# EAGLE design proto (EAGLE 7.3.0)
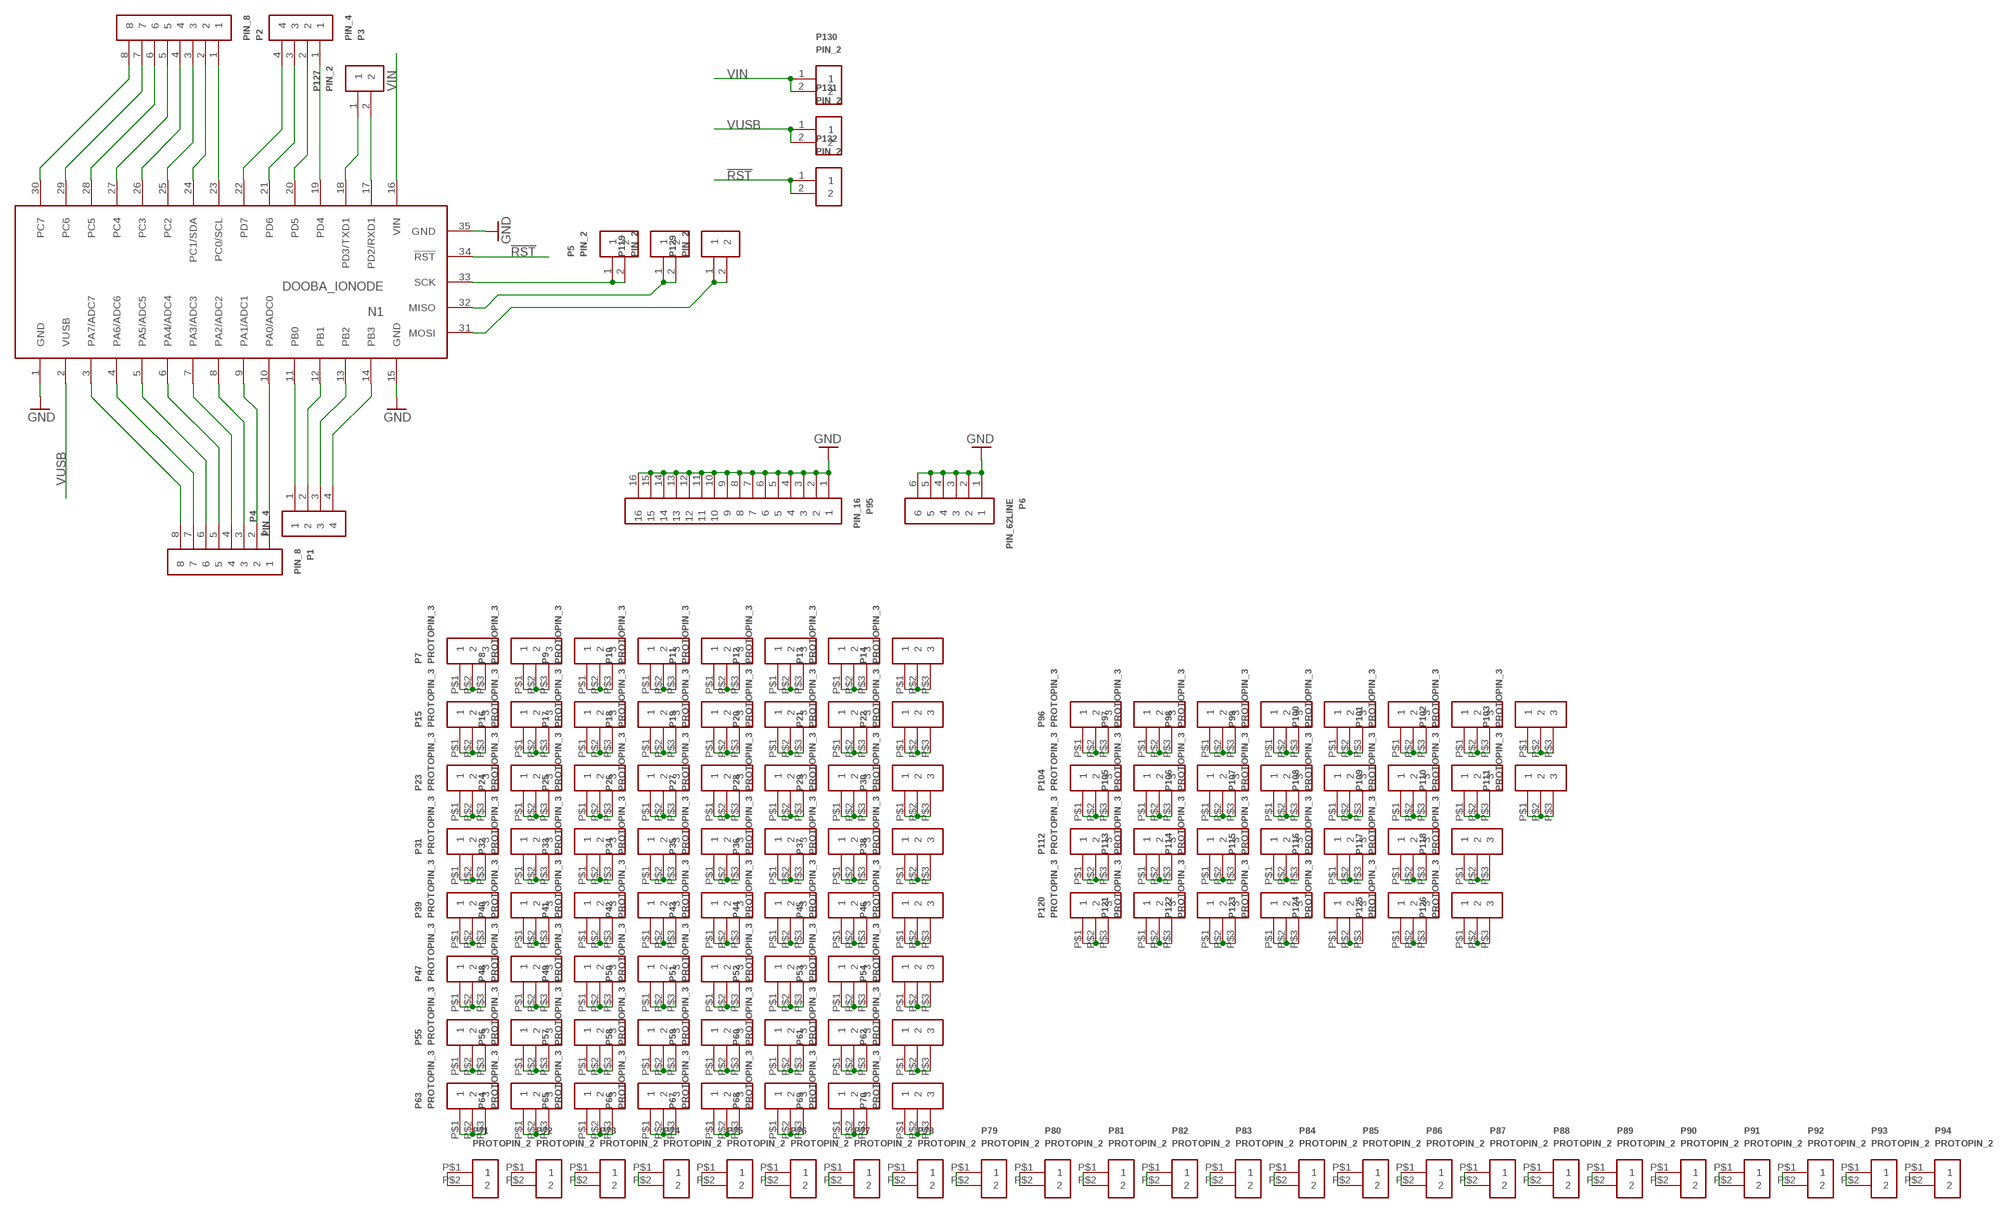
[diagram p0: schematic, sheet 1]

## Parts
N1  DOOBA_IONODE  [DOOBA_IONODE]
P1  PIN_8  [PIN_8]
P2  PIN_8  [PIN_8]
P3  PIN_4  [PIN_4]
P4  PIN_4  [PIN_4]
P5  PIN_2  [PIN_2]
P6  PIN_62LINE  [PIN_3X2]
P7  PROTOPIN_3  [PROTOPIN_3]
P8  PROTOPIN_3  [PROTOPIN_3]
P9  PROTOPIN_3  [PROTOPIN_3]
P10  PROTOPIN_3  [PROTOPIN_3]
P11  PROTOPIN_3  [PROTOPIN_3]
P12  PROTOPIN_3  [PROTOPIN_3]
P13  PROTOPIN_3  [PROTOPIN_3]
P14  PROTOPIN_3  [PROTOPIN_3]
P15  PROTOPIN_3  [PROTOPIN_3]
P16  PROTOPIN_3  [PROTOPIN_3]
P17  PROTOPIN_3  [PROTOPIN_3]
P18  PROTOPIN_3  [PROTOPIN_3]
P19  PROTOPIN_3  [PROTOPIN_3]
P20  PROTOPIN_3  [PROTOPIN_3]
P21  PROTOPIN_3  [PROTOPIN_3]
P22  PROTOPIN_3  [PROTOPIN_3]
P23  PROTOPIN_3  [PROTOPIN_3]
P24  PROTOPIN_3  [PROTOPIN_3]
P25  PROTOPIN_3  [PROTOPIN_3]
P26  PROTOPIN_3  [PROTOPIN_3]
P27  PROTOPIN_3  [PROTOPIN_3]
P28  PROTOPIN_3  [PROTOPIN_3]
P29  PROTOPIN_3  [PROTOPIN_3]
P30  PROTOPIN_3  [PROTOPIN_3]
P31  PROTOPIN_3  [PROTOPIN_3]
P32  PROTOPIN_3  [PROTOPIN_3]
P33  PROTOPIN_3  [PROTOPIN_3]
P34  PROTOPIN_3  [PROTOPIN_3]
P35  PROTOPIN_3  [PROTOPIN_3]
P36  PROTOPIN_3  [PROTOPIN_3]
P37  PROTOPIN_3  [PROTOPIN_3]
P38  PROTOPIN_3  [PROTOPIN_3]
P39  PROTOPIN_3  [PROTOPIN_3]
P40  PROTOPIN_3  [PROTOPIN_3]
P41  PROTOPIN_3  [PROTOPIN_3]
P42  PROTOPIN_3  [PROTOPIN_3]
P43  PROTOPIN_3  [PROTOPIN_3]
P44  PROTOPIN_3  [PROTOPIN_3]
P45  PROTOPIN_3  [PROTOPIN_3]
P46  PROTOPIN_3  [PROTOPIN_3]
P47  PROTOPIN_3  [PROTOPIN_3]
P48  PROTOPIN_3  [PROTOPIN_3]
P49  PROTOPIN_3  [PROTOPIN_3]
P50  PROTOPIN_3  [PROTOPIN_3]
P51  PROTOPIN_3  [PROTOPIN_3]
P52  PROTOPIN_3  [PROTOPIN_3]
P53  PROTOPIN_3  [PROTOPIN_3]
P54  PROTOPIN_3  [PROTOPIN_3]
P55  PROTOPIN_3  [PROTOPIN_3]
P56  PROTOPIN_3  [PROTOPIN_3]
P57  PROTOPIN_3  [PROTOPIN_3]
P58  PROTOPIN_3  [PROTOPIN_3]
P59  PROTOPIN_3  [PROTOPIN_3]
P60  PROTOPIN_3  [PROTOPIN_3]
P61  PROTOPIN_3  [PROTOPIN_3]
P62  PROTOPIN_3  [PROTOPIN_3]
P63  PROTOPIN_3  [PROTOPIN_3]
P64  PROTOPIN_3  [PROTOPIN_3]
P65  PROTOPIN_3  [PROTOPIN_3]
P66  PROTOPIN_3  [PROTOPIN_3]
P67  PROTOPIN_3  [PROTOPIN_3]
P68  PROTOPIN_3  [PROTOPIN_3]
P69  PROTOPIN_3  [PROTOPIN_3]
P70  PROTOPIN_3  [PROTOPIN_3]
P71  PROTOPIN_2  [PROTOPIN_2]
P72  PROTOPIN_2  [PROTOPIN_2]
P73  PROTOPIN_2  [PROTOPIN_2]
P74  PROTOPIN_2  [PROTOPIN_2]
P75  PROTOPIN_2  [PROTOPIN_2]
P76  PROTOPIN_2  [PROTOPIN_2]
P77  PROTOPIN_2  [PROTOPIN_2]
P78  PROTOPIN_2  [PROTOPIN_2]
P79  PROTOPIN_2  [PROTOPIN_2]
P80  PROTOPIN_2  [PROTOPIN_2]
P81  PROTOPIN_2  [PROTOPIN_2]
P82  PROTOPIN_2  [PROTOPIN_2]
P83  PROTOPIN_2  [PROTOPIN_2]
P84  PROTOPIN_2  [PROTOPIN_2]
P85  PROTOPIN_2  [PROTOPIN_2]
P86  PROTOPIN_2  [PROTOPIN_2]
P87  PROTOPIN_2  [PROTOPIN_2]
P88  PROTOPIN_2  [PROTOPIN_2]
P89  PROTOPIN_2  [PROTOPIN_2]
P90  PROTOPIN_2  [PROTOPIN_2]
P91  PROTOPIN_2  [PROTOPIN_2]
P92  PROTOPIN_2  [PROTOPIN_2]
P93  PROTOPIN_2  [PROTOPIN_2]
P94  PROTOPIN_2  [PROTOPIN_2]
P95  PIN_16  [PIN_16]
P96  PROTOPIN_3  [PROTOPIN_3]
P97  PROTOPIN_3  [PROTOPIN_3]
P98  PROTOPIN_3  [PROTOPIN_3]
P99  PROTOPIN_3  [PROTOPIN_3]
P100  PROTOPIN_3  [PROTOPIN_3]
P101  PROTOPIN_3  [PROTOPIN_3]
P102  PROTOPIN_3  [PROTOPIN_3]
P103  PROTOPIN_3  [PROTOPIN_3]
P104  PROTOPIN_3  [PROTOPIN_3]
P105  PROTOPIN_3  [PROTOPIN_3]
P106  PROTOPIN_3  [PROTOPIN_3]
P107  PROTOPIN_3  [PROTOPIN_3]
P108  PROTOPIN_3  [PROTOPIN_3]
P109  PROTOPIN_3  [PROTOPIN_3]
P110  PROTOPIN_3  [PROTOPIN_3]
P111  PROTOPIN_3  [PROTOPIN_3]
P112  PROTOPIN_3  [PROTOPIN_3]
P113  PROTOPIN_3  [PROTOPIN_3]
P114  PROTOPIN_3  [PROTOPIN_3]
P115  PROTOPIN_3  [PROTOPIN_3]
P116  PROTOPIN_3  [PROTOPIN_3]
P117  PROTOPIN_3  [PROTOPIN_3]
P118  PROTOPIN_3  [PROTOPIN_3]
P119  PIN_2  [PIN_2]
P120  PROTOPIN_3  [PROTOPIN_3]
P121  PROTOPIN_3  [PROTOPIN_3]
P122  PROTOPIN_3  [PROTOPIN_3]
P123  PROTOPIN_3  [PROTOPIN_3]
P124  PROTOPIN_3  [PROTOPIN_3]
P125  PROTOPIN_3  [PROTOPIN_3]
P126  PROTOPIN_3  [PROTOPIN_3]
P127  PIN_2  [PIN_2]
P129  PIN_2  [PIN_2]
P130  PIN_2  [PIN_2]
P131  PIN_2  [PIN_2]
P132  PIN_2  [PIN_2]

## Nets
!RST: N1.34(!RST) P132.1 P132.2
GND: N1.1(GND) N1.15(GND) N1.35(GND) P6.1 P6.2 P6.3 P6.4 P6.5 P6.6 P95.1 P95.2 P95.3 P95.4 P95.5 P95.6 P95.7 P95.8 P95.9 P95.10 P95.11 P95.12 P95.13 P95.14 P95.15 P95.16
N$1: N1.23(PC0/SCL) P2.1
N$2: N1.24(PC1/SDA) P2.2
N$3: N1.25(PC2) P2.3
N$4: N1.26(PC3) P2.4
N$5: N1.27(PC4) P2.5
N$6: N1.28(PC5) P2.6
N$7: N1.29(PC6) P2.7
N$8: N1.30(PC7) P2.8
N$9: N1.19(PD4) P3.1
N$10: N1.20(PD5) P3.2
N$11: N1.21(PD6) P3.3
N$12: N1.22(PD7) P3.4
N$13: N1.10(PA0/ADC0) P1.1
N$14: N1.9(PA1/ADC1) P1.2
N$15: N1.8(PA2/ADC2) P1.3
N$16: N1.7(PA3/ADC3) P1.4
N$17: N1.6(PA4/ADC4) P1.5
N$18: N1.5(PA5/ADC5) P1.6
N$19: N1.4(PA6/ADC6) P1.7
N$20: N1.3(PA7/ADC7) P1.8
N$21: N1.11(PB0) P4.1
N$22: N1.12(PB1) P4.2
N$23: N1.13(PB2) P4.3
N$24: N1.14(PB3) P4.4
N$25: N1.33(SCK) P5.1 P5.2
N$26: N1.32(MISO) P119.1 P119.2
N$27: N1.31(MOSI) P129.1 P129.2
N$28: P7.P$1 P7.P$2 P7.P$3
N$29: P8.P$1 P8.P$2 P8.P$3
N$30: P9.P$1 P9.P$2 P9.P$3
N$31: P10.P$1 P10.P$2 P10.P$3
N$32: P11.P$1 P11.P$2 P11.P$3
N$33: P12.P$1 P12.P$2 P12.P$3
N$34: P13.P$1 P13.P$2 P13.P$3
N$35: P14.P$1 P14.P$2 P14.P$3
N$36: P15.P$1 P15.P$2 P15.P$3
N$37: P16.P$1 P16.P$2 P16.P$3
N$38: P17.P$1 P17.P$2 P17.P$3
N$39: P18.P$1 P18.P$2 P18.P$3
N$40: P19.P$1 P19.P$2 P19.P$3
N$41: P20.P$1 P20.P$2 P20.P$3
N$42: P21.P$1 P21.P$2 P21.P$3
N$43: P22.P$1 P22.P$2 P22.P$3
N$44: P23.P$1 P23.P$2 P23.P$3
N$45: P24.P$1 P24.P$2 P24.P$3
N$46: P25.P$1 P25.P$2 P25.P$3
N$47: P26.P$1 P26.P$2 P26.P$3
N$48: P27.P$1 P27.P$2 P27.P$3
N$49: P28.P$1 P28.P$2 P28.P$3
N$50: P29.P$1 P29.P$2 P29.P$3
N$51: P30.P$1 P30.P$2 P30.P$3
N$52: P31.P$1 P31.P$2 P31.P$3
N$53: P32.P$1 P32.P$2 P32.P$3
N$54: P33.P$1 P33.P$2 P33.P$3
N$55: P34.P$1 P34.P$2 P34.P$3
N$56: P35.P$1 P35.P$2 P35.P$3
N$57: P36.P$1 P36.P$2 P36.P$3
N$58: P37.P$1 P37.P$2 P37.P$3
N$59: P38.P$1 P38.P$2 P38.P$3
N$60: P39.P$1 P39.P$2 P39.P$3
N$61: P40.P$1 P40.P$2 P40.P$3
N$62: P41.P$1 P41.P$2 P41.P$3
N$63: P42.P$1 P42.P$2 P42.P$3
N$64: P43.P$1 P43.P$2 P43.P$3
N$65: P44.P$1 P44.P$2 P44.P$3
N$66: P45.P$1 P45.P$2 P45.P$3
N$67: P46.P$1 P46.P$2 P46.P$3
N$68: P47.P$1 P47.P$2 P47.P$3
N$69: P48.P$1 P48.P$2 P48.P$3
N$70: P49.P$1 P49.P$2 P49.P$3
N$71: P50.P$1 P50.P$2 P50.P$3
N$72: P51.P$1 P51.P$2 P51.P$3
N$73: P52.P$1 P52.P$2 P52.P$3
N$74: P53.P$1 P53.P$2 P53.P$3
N$75: P54.P$1 P54.P$2 P54.P$3
N$76: P55.P$1 P55.P$2 P55.P$3
N$77: P56.P$1 P56.P$2 P56.P$3
N$78: P57.P$1 P57.P$2 P57.P$3
N$79: P58.P$1 P58.P$2 P58.P$3
N$80: P59.P$1 P59.P$2 P59.P$3
N$81: P60.P$1 P60.P$2 P60.P$3
N$82: P61.P$1 P61.P$2 P61.P$3
N$83: P62.P$1 P62.P$2 P62.P$3
N$84: P63.P$1 P63.P$2 P63.P$3
N$85: P64.P$1 P64.P$2 P64.P$3
N$86: P65.P$1 P65.P$2 P65.P$3
N$87: P66.P$1 P66.P$2 P66.P$3
N$88: P67.P$1 P67.P$2 P67.P$3
N$89: P68.P$1 P68.P$2 P68.P$3
N$90: P69.P$1 P69.P$2 P69.P$3
N$91: P70.P$1 P70.P$2 P70.P$3
N$92: P71.P$1 P71.P$2
N$93: P72.P$1 P72.P$2
N$94: P73.P$1 P73.P$2
N$95: P74.P$1 P74.P$2
N$96: P75.P$1 P75.P$2
N$97: P76.P$1 P76.P$2
N$98: P77.P$1 P77.P$2
N$99: P78.P$1 P78.P$2
N$100: P79.P$1 P79.P$2
N$101: P80.P$1 P80.P$2
N$102: P81.P$1 P81.P$2
N$103: P82.P$1 P82.P$2
N$104: P83.P$1 P83.P$2
N$105: P84.P$1 P84.P$2
N$106: P85.P$1 P85.P$2
N$107: P86.P$1 P86.P$2
N$108: P87.P$1 P87.P$2
N$109: P88.P$1 P88.P$2
N$110: P89.P$1 P89.P$2
N$111: P90.P$1 P90.P$2
N$112: P91.P$1 P91.P$2
N$113: P92.P$1 P92.P$2
N$114: P93.P$1 P93.P$2
N$115: P94.P$1 P94.P$2
N$116: P96.P$1 P96.P$2 P96.P$3
N$117: P97.P$1 P97.P$2 P97.P$3
N$118: P98.P$1 P98.P$2 P98.P$3
N$119: P99.P$1 P99.P$2 P99.P$3
N$120: P100.P$1 P100.P$2 P100.P$3
N$121: P101.P$1 P101.P$2 P101.P$3
N$122: P102.P$1 P102.P$2 P102.P$3
N$123: P103.P$1 P103.P$2 P103.P$3
N$124: P104.P$1 P104.P$2 P104.P$3
N$125: P105.P$1 P105.P$2 P105.P$3
N$126: P106.P$1 P106.P$2 P106.P$3
N$127: P107.P$1 P107.P$2 P107.P$3
N$128: P108.P$1 P108.P$2 P108.P$3
N$129: P109.P$1 P109.P$2 P109.P$3
N$130: P110.P$1 P110.P$2 P110.P$3
N$131: P111.P$1 P111.P$2 P111.P$3
N$132: P112.P$1 P112.P$2 P112.P$3
N$133: P113.P$1 P113.P$2 P113.P$3
N$134: P114.P$1 P114.P$2 P114.P$3
N$135: P115.P$1 P115.P$2 P115.P$3
N$136: P116.P$1 P116.P$2 P116.P$3
N$137: P117.P$1 P117.P$2 P117.P$3
N$138: P118.P$1 P118.P$2 P118.P$3
N$139: N1.17(PD2/RXD1) P127.2
N$140: P120.P$1 P120.P$2 P120.P$3
N$141: P121.P$1 P121.P$2 P121.P$3
N$142: P122.P$1 P122.P$2 P122.P$3
N$143: P123.P$1 P123.P$2 P123.P$3
N$144: P124.P$1 P124.P$2 P124.P$3
N$145: P125.P$1 P125.P$2 P125.P$3
N$146: P126.P$1 P126.P$2 P126.P$3
N$147: N1.18(PD3/TXD1) P127.1
VIN: N1.16(VIN) P130.1 P130.2
VUSB: N1.2(VUSB) P131.1 P131.2

## Library data of the parts
N1 = dooba:DOOBA_IONODE
P1 P2 = dooba:PIN_8
P3 P4 = dooba:PIN_4
P5 P119 P127 P129-P132 = dooba:PIN_2
P6 = dooba:PIN_6
P7-P70 P96-P118 P120-P126 = dooba:PROTOPIN_3
P71-P94 = dooba:PROTOPIN_2
P95 = dooba:PIN_16

## Board
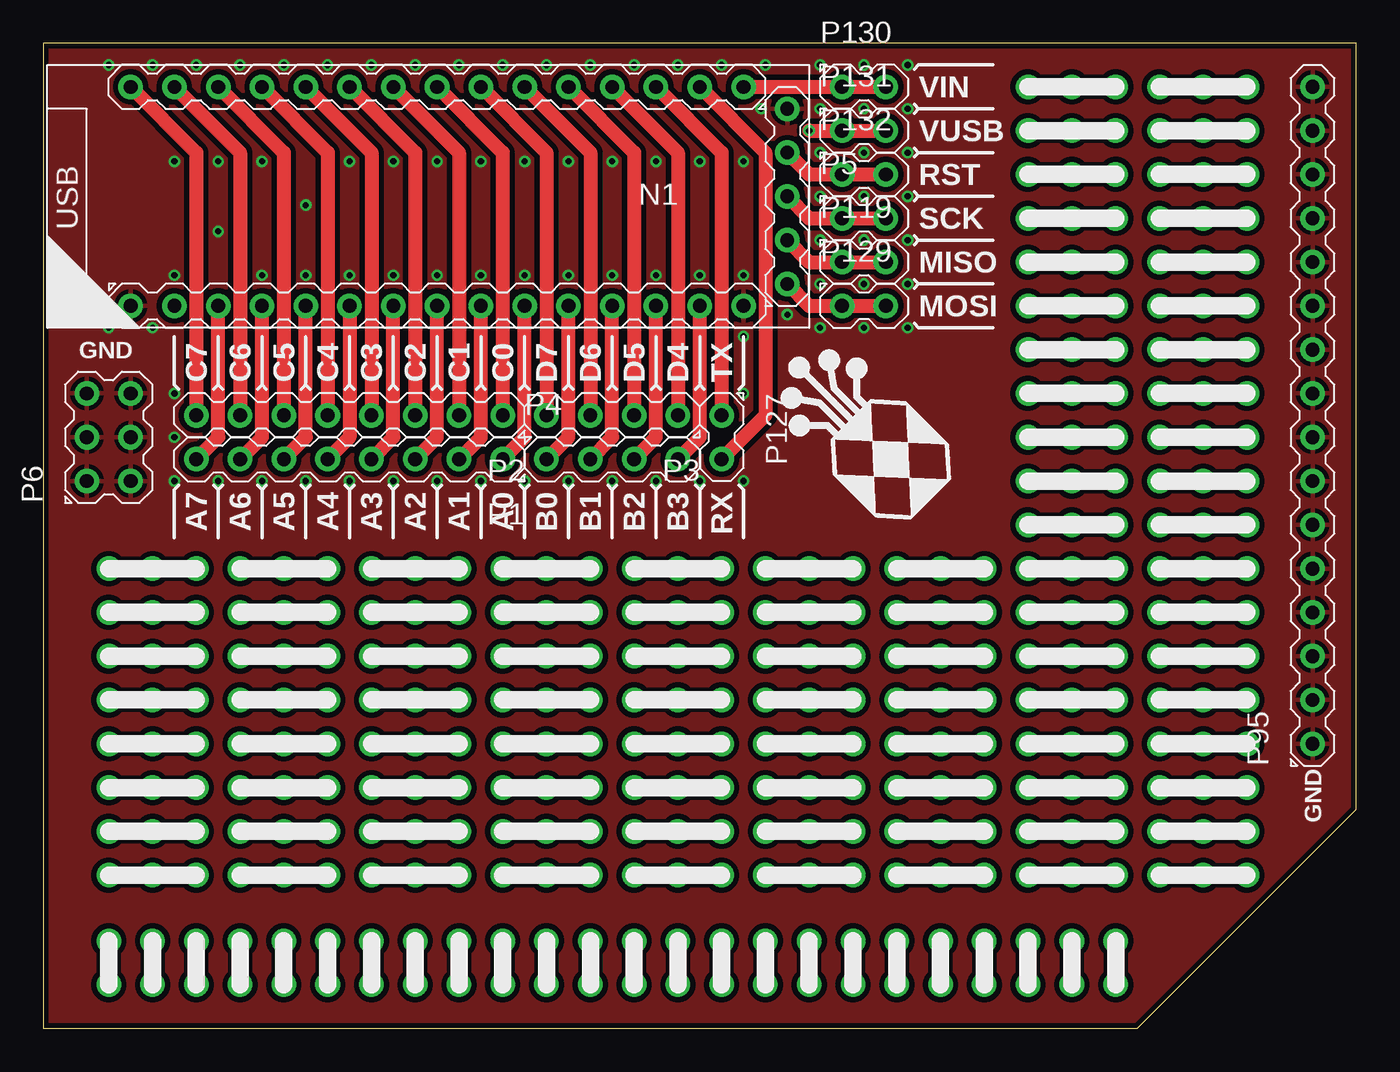
[diagram p1: board, top side]
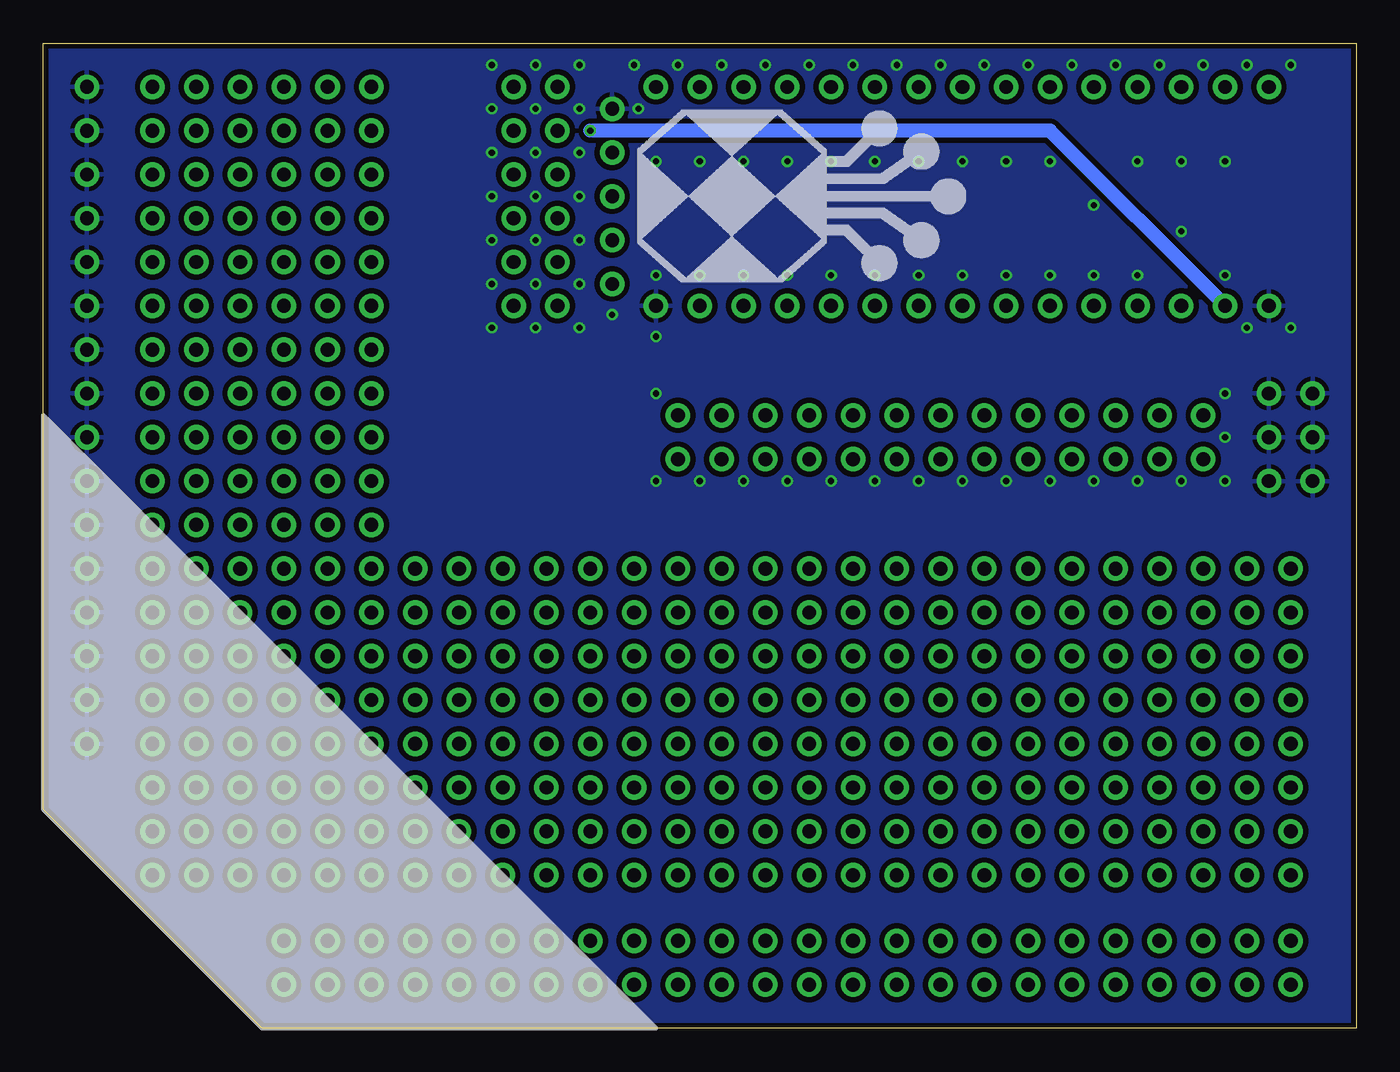
[diagram p2: board, bottom side, seen from below]

Size 76.2 x 57.15 mm. Coordinates in mm from the lower left corner, seen from the top.
Outline: 0,0 63.5,0 76.2,12.7 76.2,57.14 0,57.15 0,0
Copper layers (1*16): Top 0.035mm / dielectric 1.5mm / Bottom 0.035mm
Design rules "dooba": minimum track width 6mil, minimum drill 12mil, track to track 6mil, track to pad 6mil, pad to pad 6mil, via to via 6mil, smd to smd 0mil, copper to edge 10mil, drill to drill 10mil, minimum pad ring 10mil, minimum via ring 6mil, stop-mask expansion 2mil, vias tented up to drill 25mil, thermal gap 10mil

### Footprints (pad centres in the part's own frame; a part is rotated, then mirrored left to right if it is on the bottom)
DOOBA_IONODE = drill 0.8 pad 1.422: 1 16.51,6.35; 2 13.97,6.35; 3 11.43,6.35; 4 8.89,6.35; 5 6.35,6.35; 6 3.81,6.35; 7 1.27,6.35; 8 -1.27,6.35; 9 -3.81,6.35; 10 -6.35,6.35; 11 -8.89,6.35; 12 -11.43,6.35; 13 -13.97,6.35; 14 -16.51,6.35; 15 -19.05,6.35; 16 -19.05,-6.35; 17 -16.51,-6.35; 18 -13.97,-6.35; 19 -11.43,-6.35; 20 -8.89,-6.35; 21 -6.35,-6.35; 22 -3.81,-6.35; 23 -1.27,-6.35; 24 1.27,-6.35; 25 3.81,-6.35; 26 6.35,-6.35; 27 8.89,-6.35; 28 11.43,-6.35; 29 13.97,-6.35; 30 16.51,-6.35; 31 -21.59,5.08; 32 -21.59,2.54; 33 -21.59,0; 34 -21.59,-2.54; 35 -21.59,-5.08
PIN_8 = drill 0.8 pad 1.422: 1 -8.89,0; 2 -6.35,0; 3 -3.81,0; 4 -1.27,0; 5 1.27,0; 6 3.81,0; 7 6.35,0; 8 8.89,0
PIN_4 = drill 0.8 pad 1.422: 1 -3.81,0; 2 -1.27,0; 3 1.27,0; 4 3.81,0
PIN_2 = drill 0.8 pad 1.422: 1 -1.27,0; 2 1.27,0
PIN_3X2 = drill 0.8 pad 1.422: 1 -2.54,1.27; 2 0,1.27; 3 2.54,1.27; 4 -2.54,-1.27; 5 0,-1.27; 6 2.54,-1.27
PROTOPIN_3 = drill 0.8 pad 1.422: P$1 -2.54,0; P$2 0,0; P$3 2.54,0
PROTOPIN_2 = drill 0.8 pad 1.422: P$1 -1.27,0; P$2 1.27,0
PIN_16 = drill 0.8 pad 1.422: 1 -19.05,0; 2 -16.51,0; 3 -13.97,0; 4 -11.43,0; 5 -8.89,0; 6 -6.35,0; 7 -3.81,0; 8 -1.27,0; 9 1.27,0; 10 3.81,0; 11 6.35,0; 12 8.89,0; 13 11.43,0; 14 13.97,0; 15 16.51,0; 16 19.05,0

### Placement (x,y rotation side)
N1  21.59,48.26 180 top
P1  17.78,33.02 180 top
P2  17.78,35.56 180 top
P3  33.02,35.56 180 top
P4  33.02,33.02 0 top
P5  47.62,46.99 0 top
P6  3.81,34.29 90 top
P7  29.21,8.89 0 top
P8  44.45,24.13 0 top
P9  52.07,24.13 0 top
P10  59.69,24.13 0 top
P11  67.31,24.13 0 top
P12  6.35,13.97 0 top
P13  6.35,8.89 0 top
P14  13.97,13.97 0 top
P15  13.97,11.43 0 top
P16  13.97,8.89 0 top
P17  29.21,11.43 0 top
P18  13.97,24.13 0 top
P19  21.59,24.13 0 top
P20  29.21,24.13 0 top
P21  36.83,24.13 0 top
P22  6.35,16.51 0 top
P23  29.21,21.59 0 top
P24  13.97,16.51 0 top
P25  21.59,19.05 0 top
P26  21.59,11.43 0 top
P27  29.21,13.97 0 top
P28  59.69,52.07 0 top
P29  67.31,52.07 0 top
P30  59.69,54.61 0 top
P31  67.31,54.61 0 top
P32  6.35,19.05 0 top
P33  6.35,11.43 0 top
P34  13.97,19.05 0 top
P35  29.21,19.05 0 top
P36  21.59,13.97 0 top
P37  29.21,16.51 0 top
P38  59.69,44.45 0 top
P39  67.31,44.45 0 top
P40  59.69,46.99 0 top
P41  59.69,49.53 0 top
P42  67.31,46.99 0 top
P43  67.31,49.53 0 top
P44  13.97,21.59 0 top
P45  21.59,21.59 0 top
P46  21.59,16.51 0 top
P47  21.59,8.89 0 top
P48  59.69,34.29 0 top
P49  67.31,34.29 0 top
P50  59.69,36.83 0 top
P51  67.31,36.83 0 top
P52  59.69,39.37 0 top
P53  67.31,39.37 0 top
P54  59.69,41.91 0 top
P55  67.31,41.91 0 top
P56  6.35,21.59 0 top
P57  6.35,24.13 0 top
P58  67.31,31.75 0 top
P59  59.69,31.75 0 top
P60  67.31,29.21 0 top
P61  59.69,29.21 0 top
P62  67.31,26.67 0 top
P63  59.69,26.67 0 top
P64  52.07,26.67 0 top
P65  44.45,26.67 0 top
P66  36.83,26.67 0 top
P67  6.35,26.67 0 top
P68  29.21,26.67 0 top
P69  21.59,26.67 0 top
P70  13.97,26.67 0 top
P71  44.45,3.81 90 top
P72  36.83,3.81 90 top
P73  31.75,3.81 90 top
P74  26.67,3.81 90 top
P75  24.13,3.81 90 top
P76  16.51,3.81 90 top
P77  11.43,3.81 90 top
P78  8.89,3.81 90 top
P79  19.05,3.81 90 top
P80  41.91,3.81 90 top
P81  62.23,3.81 90 top
P82  59.69,3.81 90 top
P83  57.15,3.81 90 top
P84  54.61,3.81 90 top
P85  52.07,3.81 90 top
P86  49.53,3.81 90 top
P87  46.99,3.81 90 top
P88  39.37,3.81 90 top
P89  34.29,3.81 90 top
P90  29.21,3.81 90 top
P91  21.59,3.81 90 top
P92  13.97,3.81 90 top
P93  6.35,3.81 90 top
P94  3.81,3.81 90 top
P95  73.66,35.56 90 top
P96  36.83,19.05 0 top
P97  36.83,16.51 0 top
P98  36.83,13.97 0 top
P99  36.83,11.43 0 top
P100  36.83,21.59 0 top
P101  36.83,8.89 0 top
P102  44.45,21.59 0 top
P103  44.45,19.05 0 top
P104  44.45,16.51 0 top
P105  44.45,13.97 0 top
P106  44.45,8.89 0 top
P107  52.07,21.59 0 top
P108  52.07,19.05 0 top
P109  52.07,16.51 0 top
P110  44.45,11.43 0 top
P111  52.07,13.97 0 top
P112  52.07,11.43 0 top
P113  52.07,8.89 0 top
P114  59.69,21.59 0 top
P115  59.69,19.05 0 top
P116  59.69,8.89 0 top
P117  59.69,11.43 0 top
P118  59.69,13.97 0 top
P119  47.62,44.45 0 top
P120  59.69,16.51 0 top
P121  67.31,19.05 0 top
P122  67.31,16.51 0 top
P123  67.31,13.97 0 top
P124  67.31,11.43 0 top
P125  67.31,8.89 0 top
P126  67.31,21.59 0 top
P127  39.37,34.29 270 top
P129  47.62,41.91 0 top
P130  47.62,54.61 0 top
P131  47.62,52.07 0 top
P132  47.62,49.53 0 top

### Tracks (layer width: path | path; a pad name or v marks a point on that pad's centre or on a via)
!RST
  Top 0.813: N1.34 44.45,49.53 P132.1 P132.2
GND  (via drill 0.36)
  other vias: 40.64,43.69 38.1,43.69 35.56,43.69 33.02,43.69 30.48,43.69 27.94,43.69 25.4,43.69 22.86,43.69 20.32,43.69 17.78,43.69 15.24,43.69 12.7,43.69 10.16,46.23 10.16,50.29 12.7,50.29 15.24,47.75 17.78,50.29 20.32,50.29 22.86,50.29 25.4,50.29 27.94,50.29 30.48,50.29 33.02,50.29 35.56,50.29 38.1,50.29 40.64,50.29 41.66,53.34 7.62,50.29 7.62,43.69 7.62,34.29 10.16,31.75 12.7,31.75 15.24,31.75 17.78,31.75 20.32,31.75 22.86,31.75 25.4,31.75 27.94,31.75 30.48,31.75 33.02,31.75 35.56,31.75 38.1,31.75 40.64,31.75 40.64,36.83 7.62,31.75 7.62,36.83 43.18,41.4 6.35,55.88 8.89,55.88 11.43,55.88 13.97,55.88 16.51,55.88 3.81,55.88 6.35,40.64 3.81,40.64 40.64,40.13 19.05,55.88 21.59,55.88 24.13,55.88 26.67,55.88 29.21,55.88 31.75,55.88 34.29,55.88 36.83,55.88 39.37,55.88 41.91,55.88 47.62,55.88 47.62,53.34 47.62,50.8 47.62,48.26 47.62,45.72 47.62,43.18 47.62,40.64 50.16,40.64 50.16,43.18 50.16,45.72 50.16,48.26 50.16,50.8 50.16,53.34 50.16,55.88 45.09,55.88 45.09,53.34 45.09,50.8 45.09,48.26 45.09,45.72 45.09,43.18 45.09,40.64
  pour Top (isolate 0.305): 0,57.15 0,0 63.5,0 76.2,12.7 76.2,57.15
  pour Bottom (isolate 0.305): 0,57.15 0,0 63.5,0 76.2,12.7 76.2,57.15
N$1
  Top 0.813: N1.23 26.67,50.8 P2.1
N$2
  Top 0.813: N1.24 24.13,50.8 P2.2
N$3
  Top 0.813: N1.25 21.59,50.8 P2.3
N$4
  Top 0.813: N1.26 19.05,50.8 P2.4
N$5
  Top 0.813: N1.27 16.51,50.8 P2.5
N$6
  Top 0.813: N1.28 13.97,50.8 P2.6
N$7
  Top 0.813: N1.29 11.43,50.8 P2.7
N$8
  Top 0.813: N1.30 8.89,50.8 P2.8
N$9
  Top 0.813: N1.19 36.83,50.8 P3.1
N$10
  Top 0.813: N1.20 34.29,50.8 P3.2
N$11
  Top 0.813: N1.21 31.75,50.8 P3.3
N$12
  Top 0.813: N1.22 29.21,50.8 P3.4
N$13
  Top 0.813: P1.1 27.94,34.29 N1.10
N$14
  Top 0.813: P1.2 25.4,34.29 N1.9
N$15
  Top 0.813: P1.3 22.86,34.29 N1.8
N$16
  Top 0.813: P1.4 20.32,34.29 N1.7
N$17
  Top 0.813: N1.6 17.78,34.29 P1.5
N$18
  Top 0.813: P1.6 15.24,34.29 N1.5
N$19
  Top 0.813: P1.7 12.7,34.29 N1.4
N$20
  Top 0.813: P1.8 10.16,34.29 N1.3
N$21
  Top 0.813: P4.1 30.48,34.29 N1.11
N$22
  Top 0.813: P4.2 33.02,34.29 N1.12
N$23
  Top 0.813: P4.3 35.56,34.29 N1.13
N$24
  Top 0.813: P4.4 38.1,34.29 N1.14
N$25
  Top 0.813: N1.33 44.45,46.99 P5.1 P5.2
N$26
  Top 0.813: N1.32 44.45,44.45 P119.1 P119.2
N$27
  Top 0.813: N1.31 44.45,41.91 P129.1 P129.2
N$28
  Top 0.813: P7.P$1 P7.P$2 P7.P$3
N$29
  Top 0.813: P8.P$1 P8.P$2 P8.P$3
N$30
  Top 0.813: P9.P$1 P9.P$2 P9.P$3
N$31
  Top 0.813: P10.P$1 P10.P$2 P10.P$3
N$32
  Top 0.813: P11.P$1 P11.P$2 P11.P$3
N$33
  Top 0.813: P12.P$1 P12.P$2 P12.P$3
N$34
  Top 0.813: P13.P$1 P13.P$2 P13.P$3
N$35
  Top 0.813: P14.P$1 P14.P$2 P14.P$3
N$36
  Top 0.813: P15.P$1 P15.P$2 P15.P$3
N$37
  Top 0.813: P16.P$1 P16.P$2 P16.P$3
N$38
  Top 0.813: P17.P$1 P17.P$2 P17.P$3
N$39
  Top 0.813: P18.P$1 P18.P$2 P18.P$3
N$40
  Top 0.813: P19.P$1 P19.P$2 P19.P$3
N$41
  Top 0.813: P20.P$1 P20.P$2 P20.P$3
N$42
  Top 0.813: P21.P$1 P21.P$2 P21.P$3
N$43
  Top 0.813: P22.P$1 P22.P$2 P22.P$3
N$44
  Top 0.813: P23.P$1 P23.P$2 P23.P$3
N$45
  Top 0.813: P24.P$1 P24.P$2 P24.P$3
N$46
  Top 0.813: P25.P$1 P25.P$2 P25.P$3
N$47
  Top 0.813: P26.P$1 P26.P$2 P26.P$3
N$48
  Top 0.813: P27.P$1 P27.P$2 P27.P$3
N$49
  Top 0.813: P28.P$3 P28.P$2 P28.P$1
N$50
  Top 0.813: P29.P$3 P29.P$2 P29.P$1
N$51
  Top 0.813: P30.P$1 P30.P$2 P30.P$3
N$52
  Top 0.813: P31.P$1 P31.P$2 P31.P$3
N$53
  Top 0.813: P32.P$1 P32.P$2 P32.P$3
N$54
  Top 0.813: P33.P$1 P33.P$2 P33.P$3
N$55
  Top 0.813: P34.P$1 P34.P$2 P34.P$3
N$56
  Top 0.813: P35.P$1 P35.P$2 P35.P$3
N$57
  Top 0.813: P36.P$1 P36.P$2 P36.P$3
N$58
  Top 0.813: P37.P$1 P37.P$2 P37.P$3
N$59
  Top 0.813: P38.P$1 P38.P$2 P38.P$3
N$60
  Top 0.813: P39.P$1 P39.P$2 P39.P$3
N$61
  Top 0.813: P40.P$3 P40.P$2 P40.P$1
N$62
  Top 0.813: P41.P$1 P41.P$2 P41.P$3
N$63
  Top 0.813: P42.P$3 P42.P$2 P42.P$1
N$64
  Top 0.813: P43.P$1 P43.P$2 P43.P$3
N$65
  Top 0.813: P44.P$1 P44.P$2 P44.P$3
N$66
  Top 0.813: P45.P$1 P45.P$2 P45.P$3
N$67
  Top 0.813: P46.P$1 P46.P$2 P46.P$3
N$68
  Top 0.813: P47.P$1 P47.P$2 P47.P$3
N$69
  Top 0.813: P48.P$1 P48.P$2 P48.P$3
N$70
  Top 0.813: P49.P$1 P49.P$2 P49.P$3
N$71
  Top 0.813: P50.P$3 P50.P$2 P50.P$1
N$72
  Top 0.813: P51.P$3 P51.P$2 P51.P$1
N$73
  Top 0.813: P52.P$1 P52.P$2 P52.P$3
N$74
  Top 0.813: P53.P$1 P53.P$2 P53.P$3
N$75
  Top 0.813: P54.P$3 P54.P$2 P54.P$1
N$76
  Top 0.813: P55.P$3 P55.P$2 P55.P$1
N$77
  Top 0.813: P56.P$1 P56.P$2 P56.P$3
N$78
  Top 0.813: P57.P$1 P57.P$2 P57.P$3
N$79
  Top 0.813: P58.P$3 P58.P$2 P58.P$1
N$80
  Top 0.813: P59.P$3 P59.P$2 P59.P$1
N$81
  Top 0.813: P60.P$1 P60.P$2 P60.P$3
N$82
  Top 0.813: P61.P$1 P61.P$2 P61.P$3
N$83
  Top 0.813: P62.P$3 P62.P$2 P62.P$1
N$84
  Top 0.813: P63.P$3 P63.P$2 P63.P$1
N$85
  Top 0.813: P64.P$1 P64.P$2 P64.P$3
N$86
  Top 0.813: P65.P$1 P65.P$2 P65.P$3
N$87
  Top 0.813: P66.P$1 P66.P$2 P66.P$3
N$88
  Top 0.813: P67.P$1 P67.P$2 P67.P$3
N$89
  Top 0.813: P68.P$1 P68.P$2 P68.P$3
N$90
  Top 0.813: P69.P$1 P69.P$2 P69.P$3
N$91
  Top 0.813: P70.P$1 P70.P$2 P70.P$3
N$92
  Top 0.813: P71.P$2 P71.P$1
N$93
  Top 0.813: P72.P$2 P72.P$1
N$94
  Top 0.813: P73.P$2 P73.P$1
N$95
  Top 0.813: P74.P$2 P74.P$1
N$96
  Top 0.813: P75.P$2 P75.P$1
N$97
  Top 0.813: P76.P$2 P76.P$1
N$98
  Top 0.813: P77.P$2 P77.P$1
N$99
  Top 0.813: P78.P$2 P78.P$1
N$100
  Top 0.813: P79.P$2 P79.P$1
N$101
  Top 0.813: P80.P$2 P80.P$1
N$102
  Top 0.813: P81.P$2 P81.P$1
N$103
  Top 0.813: P82.P$2 P82.P$1
N$104
  Top 0.813: P83.P$2 P83.P$1
N$105
  Top 0.813: P84.P$2 P84.P$1
N$106
  Top 0.813: P85.P$2 P85.P$1
N$107
  Top 0.813: P86.P$2 P86.P$1
N$108
  Top 0.813: P87.P$2 P87.P$1
N$109
  Top 0.813: P88.P$2 P88.P$1
N$110
  Top 0.813: P89.P$2 P89.P$1
N$111
  Top 0.813: P90.P$2 P90.P$1
N$112
  Top 0.813: P91.P$2 P91.P$1
N$113
  Top 0.813: P92.P$2 P92.P$1
N$114
  Top 0.813: P93.P$2 P93.P$1
N$115
  Top 0.813: P94.P$2 P94.P$1
N$116
  Top 0.813: P96.P$1 P96.P$2 P96.P$3
N$117
  Top 0.813: P97.P$1 P97.P$2 P97.P$3
N$118
  Top 0.813: P98.P$1 P98.P$2 P98.P$3
N$119
  Top 0.813: P99.P$1 P99.P$2 P99.P$3
N$120
  Top 0.813: P100.P$1 P100.P$2 P100.P$3
N$121
  Top 0.813: P101.P$1 P101.P$2 P101.P$3
N$122
  Top 0.813: P102.P$1 P102.P$2 P102.P$3
N$123
  Top 0.813: P103.P$1 P103.P$2 P103.P$3
N$124
  Top 0.813: P104.P$1 P104.P$2 P104.P$3
N$125
  Top 0.813: P105.P$1 P105.P$2 P105.P$3
N$126
  Top 0.813: P106.P$1 P106.P$2 P106.P$3
N$127
  Top 0.813: P107.P$1 P107.P$2 P107.P$3
N$128
  Top 0.813: P108.P$1 P108.P$2 P108.P$3
N$129
  Top 0.813: P109.P$1 P109.P$2 P109.P$3
N$130
  Top 0.813: P110.P$1 P110.P$2 P110.P$3
N$131
  Top 0.813: P111.P$1 P111.P$2 P111.P$3
N$132
  Top 0.813: P112.P$1 P112.P$2 P112.P$3
N$133
  Top 0.813: P113.P$1 P113.P$2 P113.P$3
N$134
  Top 0.813: P114.P$3 P114.P$2 P114.P$1
N$135
  Top 0.813: P115.P$1 P115.P$2 P115.P$3
N$136
  Top 0.813: P116.P$1 P116.P$2 P116.P$3
N$137
  Top 0.813: P117.P$1 P117.P$2 P117.P$3
N$138
  Top 0.813: P118.P$1 P118.P$2 P118.P$3
N$139
  Top 0.813: N1.17 41.91,50.8 41.91,35.56 P127.2
N$140
  Top 0.813: P120.P$3 P120.P$2 P120.P$1
N$141
  Top 0.813: P121.P$1 P121.P$2 P121.P$3
N$142
  Top 0.813: P122.P$3 P122.P$2 P122.P$1
N$143
  Top 0.813: P123.P$1 P123.P$2 P123.P$3
N$144
  Top 0.813: P124.P$1 P124.P$2 P124.P$3
N$145
  Top 0.813: P125.P$3 P125.P$2 P125.P$1
N$146
  Top 0.813: P126.P$3 P126.P$2 P126.P$1
N$147
  Top 0.813: N1.18 39.37,50.8 P127.1
VIN
  Top 0.813: N1.16 P130.1 P130.2
VUSB  (via drill 0.36)
  Top 0.813: v44.45,52.07 P131.1 P131.2
  Bottom 0.813: N1.2 17.78,52.07 v44.45,52.07

### Text on the board
tPlace: VIN | VUSB | RST | SCK | MISO | MOSI | GND | C7 | C6 | C5 | C4 | C3 | C2 | C1 | C0 | D7 | D6 | D5 | D4 | TX | A7 | A6 | A5 | A4 | A3 | A2 | A1 | A0 | B0 | B1 | B2 | B3 | RX | GND